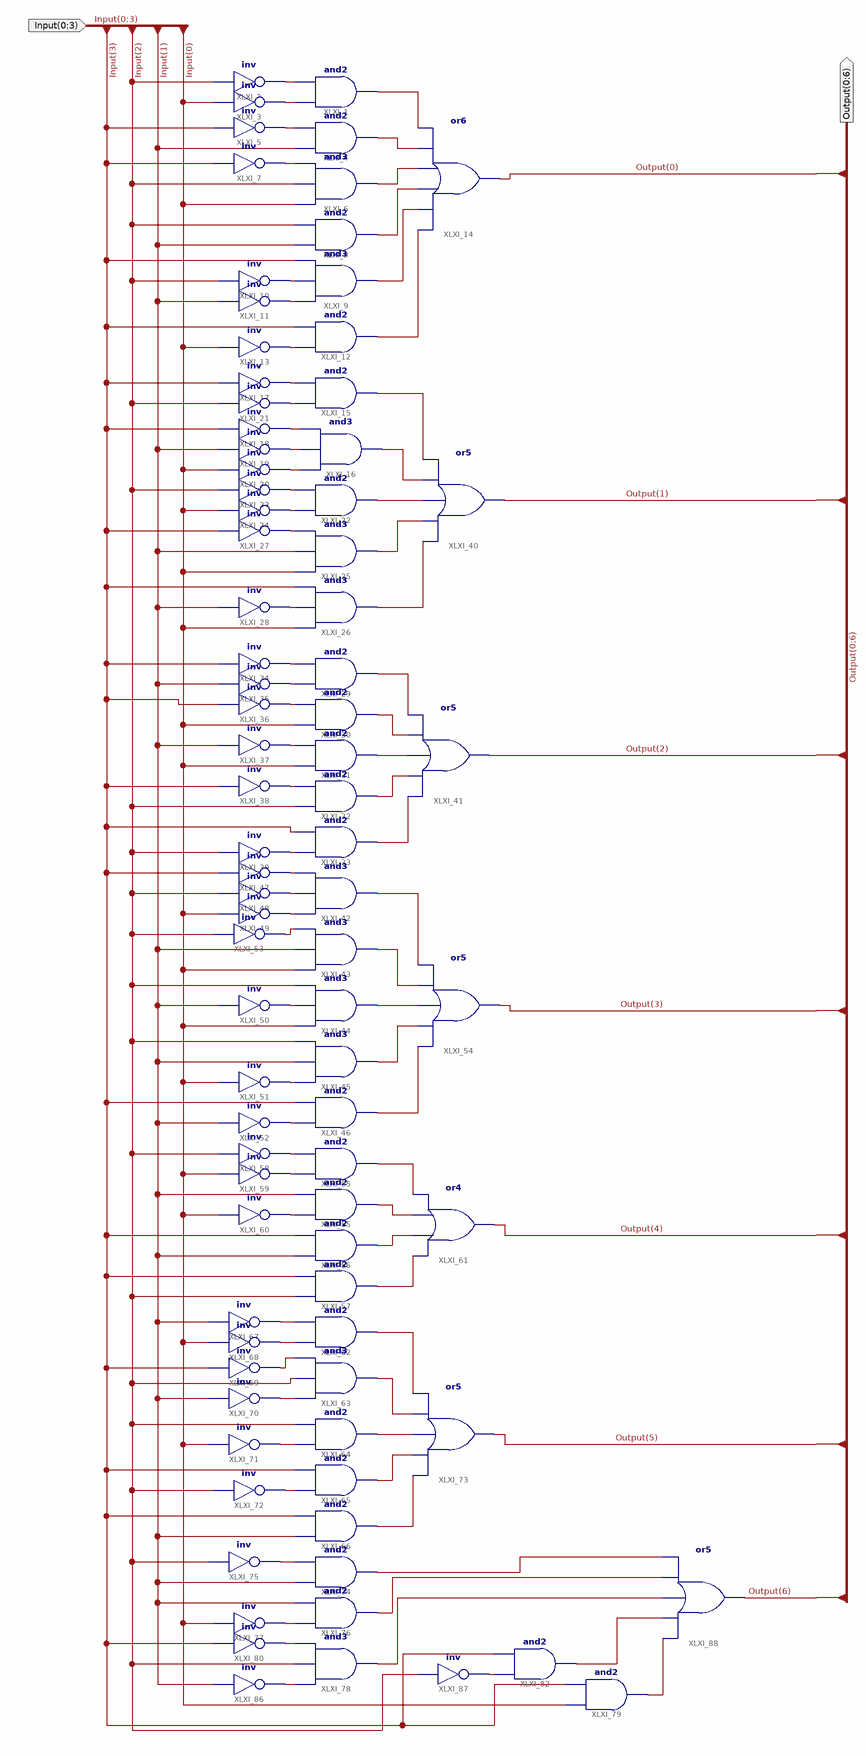
[diagram p0: schematic sheet 1]
// Xilinx ISE schematic decodToSeg.sch (spartan6) as structural Verilog: 85 symbols, 2 ports
module decodToSeg (
  input  [0:3] Input,
  output [0:6] Output
);

  wire XLXN_5, XLXN_6, XLXN_7, XLXN_8, XLXN_9, XLXN_10, XLXN_11, XLXN_12, XLXN_13, XLXN_14, XLXN_15, XLXN_16,
       XLXN_17, XLXN_18, XLXN_19, XLXN_20, XLXN_21, XLXN_22, XLXN_23, XLXN_24, XLXN_25, XLXN_26, XLXN_27,
       XLXN_28, XLXN_29, XLXN_30, XLXN_31, XLXN_32, XLXN_33, XLXN_34, XLXN_35, XLXN_36, XLXN_38, XLXN_39,
       XLXN_40, XLXN_41, XLXN_42, XLXN_43, XLXN_44, XLXN_45, XLXN_46, XLXN_47, XLXN_48, XLXN_49, XLXN_50,
       XLXN_51, XLXN_52, XLXN_53, XLXN_54, XLXN_55, XLXN_56, XLXN_57, XLXN_58, XLXN_59, XLXN_60, XLXN_61,
       XLXN_62, XLXN_63, XLXN_64, XLXN_65, XLXN_66, XLXN_67, XLXN_68, XLXN_71, XLXN_72, XLXN_73, XLXN_74,
       XLXN_81, XLXN_82, XLXN_84, XLXN_85, XLXN_86, XLXN_87, XLXN_88, XLXN_89, XLXN_93, XLXN_94, XLXN_95;

  and XLXI_1 (XLXN_12, XLXN_6, XLXN_5);
  not XLXI_2 (XLXN_5, Input[2]);
  not XLXI_3 (XLXN_6, Input[0]);
  and XLXI_4 (XLXN_13, Input[1], XLXN_7);
  not XLXI_5 (XLXN_7, Input[3]);
  and XLXI_6 (XLXN_14, Input[0], Input[2], XLXN_8);
  not XLXI_7 (XLXN_8, Input[3]);
  and XLXI_8 (XLXN_15, Input[1], Input[2]);
  and XLXI_9 (XLXN_16, XLXN_10, XLXN_9, Input[3]);
  not XLXI_10 (XLXN_9, Input[2]);
  not XLXI_11 (XLXN_10, Input[1]);
  and XLXI_12 (XLXN_17, XLXN_11, Input[3]);
  not XLXI_13 (XLXN_11, Input[0]);
  or XLXI_14 (Output[0], XLXN_17, XLXN_16, XLXN_15, XLXN_14, XLXN_13, XLXN_12);
  and XLXI_15 (XLXN_23, XLXN_19, XLXN_18);
  and XLXI_16 (XLXN_24, XLXN_22, XLXN_21, XLXN_20);
  not XLXI_17 (XLXN_18, Input[3]);
  not XLXI_18 (XLXN_20, Input[3]);
  not XLXI_19 (XLXN_21, Input[1]);
  not XLXI_20 (XLXN_22, Input[0]);
  not XLXI_21 (XLXN_19, Input[2]);
  and XLXI_22 (XLXN_25, XLXN_29, XLXN_28);
  not XLXI_23 (XLXN_28, Input[2]);
  not XLXI_24 (XLXN_29, Input[0]);
  and XLXI_25 (XLXN_26, Input[0], Input[1], XLXN_30);
  and XLXI_26 (XLXN_27, Input[0], XLXN_31, Input[3]);
  not XLXI_27 (XLXN_30, Input[3]);
  not XLXI_28 (XLXN_31, Input[1]);
  and XLXI_29 (XLXN_32, XLXN_94, XLXN_95);
  and XLXI_30 (XLXN_33, Input[0], XLXN_93);
  and XLXI_31 (XLXN_34, Input[0], XLXN_89);
  and XLXI_32 (XLXN_35, Input[2], XLXN_88);
  and XLXI_33 (XLXN_36, XLXN_87, Input[3]);
  not XLXI_34 (XLXN_95, Input[3]);
  not XLXI_35 (XLXN_94, Input[1]);
  not XLXI_36 (XLXN_93, Input[3]);
  not XLXI_37 (XLXN_89, Input[1]);
  not XLXI_38 (XLXN_88, Input[3]);
  not XLXI_39 (XLXN_87, Input[2]);
  or XLXI_40 (Output[1], XLXN_27, XLXN_26, XLXN_25, XLXN_24, XLXN_23);
  or XLXI_41 (Output[2], XLXN_36, XLXN_35, XLXN_34, XLXN_33, XLXN_32);
  and XLXI_42 (XLXN_42, XLXN_84, XLXN_85, XLXN_86);
  and XLXI_43 (XLXN_43, Input[0], Input[1], XLXN_38);
  and XLXI_44 (XLXN_44, Input[0], XLXN_39, Input[2]);
  and XLXI_45 (XLXN_45, XLXN_40, Input[1], Input[2]);
  and XLXI_46 (XLXN_46, XLXN_41, Input[3]);
  not XLXI_47 (XLXN_86, Input[3]);
  not XLXI_48 (XLXN_85, Input[2]);
  not XLXI_49 (XLXN_84, Input[0]);
  not XLXI_50 (XLXN_39, Input[1]);
  not XLXI_51 (XLXN_40, Input[0]);
  not XLXI_52 (XLXN_41, Input[1]);
  not XLXI_53 (XLXN_38, Input[2]);
  or XLXI_54 (Output[3], XLXN_46, XLXN_45, XLXN_44, XLXN_43, XLXN_42);
  and XLXI_55 (XLXN_51, XLXN_49, Input[1]);
  and XLXI_56 (XLXN_52, Input[1], Input[3]);
  and XLXI_57 (XLXN_53, Input[2], Input[3]);
  not XLXI_58 (XLXN_47, Input[2]);
  not XLXI_59 (XLXN_48, Input[0]);
  not XLXI_60 (XLXN_49, Input[0]);
  or XLXI_61 (Output[4], XLXN_53, XLXN_52, XLXN_51, XLXN_50);
  and XLXI_62 (XLXN_60, XLXN_55, XLXN_54);
  and XLXI_63 (XLXN_61, XLXN_57, Input[2], XLXN_56);
  and XLXI_64 (XLXN_62, XLXN_58, Input[2]);
  and XLXI_65 (XLXN_63, XLXN_59, Input[3]);
  and XLXI_66 (XLXN_64, Input[1], Input[3]);
  not XLXI_67 (XLXN_54, Input[1]);
  not XLXI_68 (XLXN_55, Input[0]);
  not XLXI_69 (XLXN_56, Input[3]);
  not XLXI_70 (XLXN_57, Input[1]);
  not XLXI_71 (XLXN_58, Input[0]);
  not XLXI_72 (XLXN_59, Input[2]);
  or XLXI_73 (Output[5], XLXN_64, XLXN_63, XLXN_62, XLXN_61, XLXN_60);
  and XLXI_74 (XLXN_74, Input[1], XLXN_65);
  not XLXI_75 (XLXN_65, Input[2]);
  and XLXI_76 (XLXN_73, XLXN_66, Input[1]);
  not XLXI_77 (XLXN_66, Input[0]);
  and XLXI_78 (XLXN_72, XLXN_68, Input[2], XLXN_67);
  and XLXI_79 (XLXN_82, Input[0], Input[3]);
  not XLXI_80 (XLXN_67, Input[3]);
  not XLXI_86 (XLXN_68, Input[1]);
  and XLXI_82 (XLXN_71, XLXN_81, Input[3]);
  not XLXI_87 (XLXN_81, Input[2]);
  or XLXI_88 (Output[6], XLXN_82, XLXN_71, XLXN_72, XLXN_73, XLXN_74);
  and XLXI_85 (XLXN_50, XLXN_48, XLXN_47);
endmodule
